# Altium schematic sheet Main.SchDoc
size A4
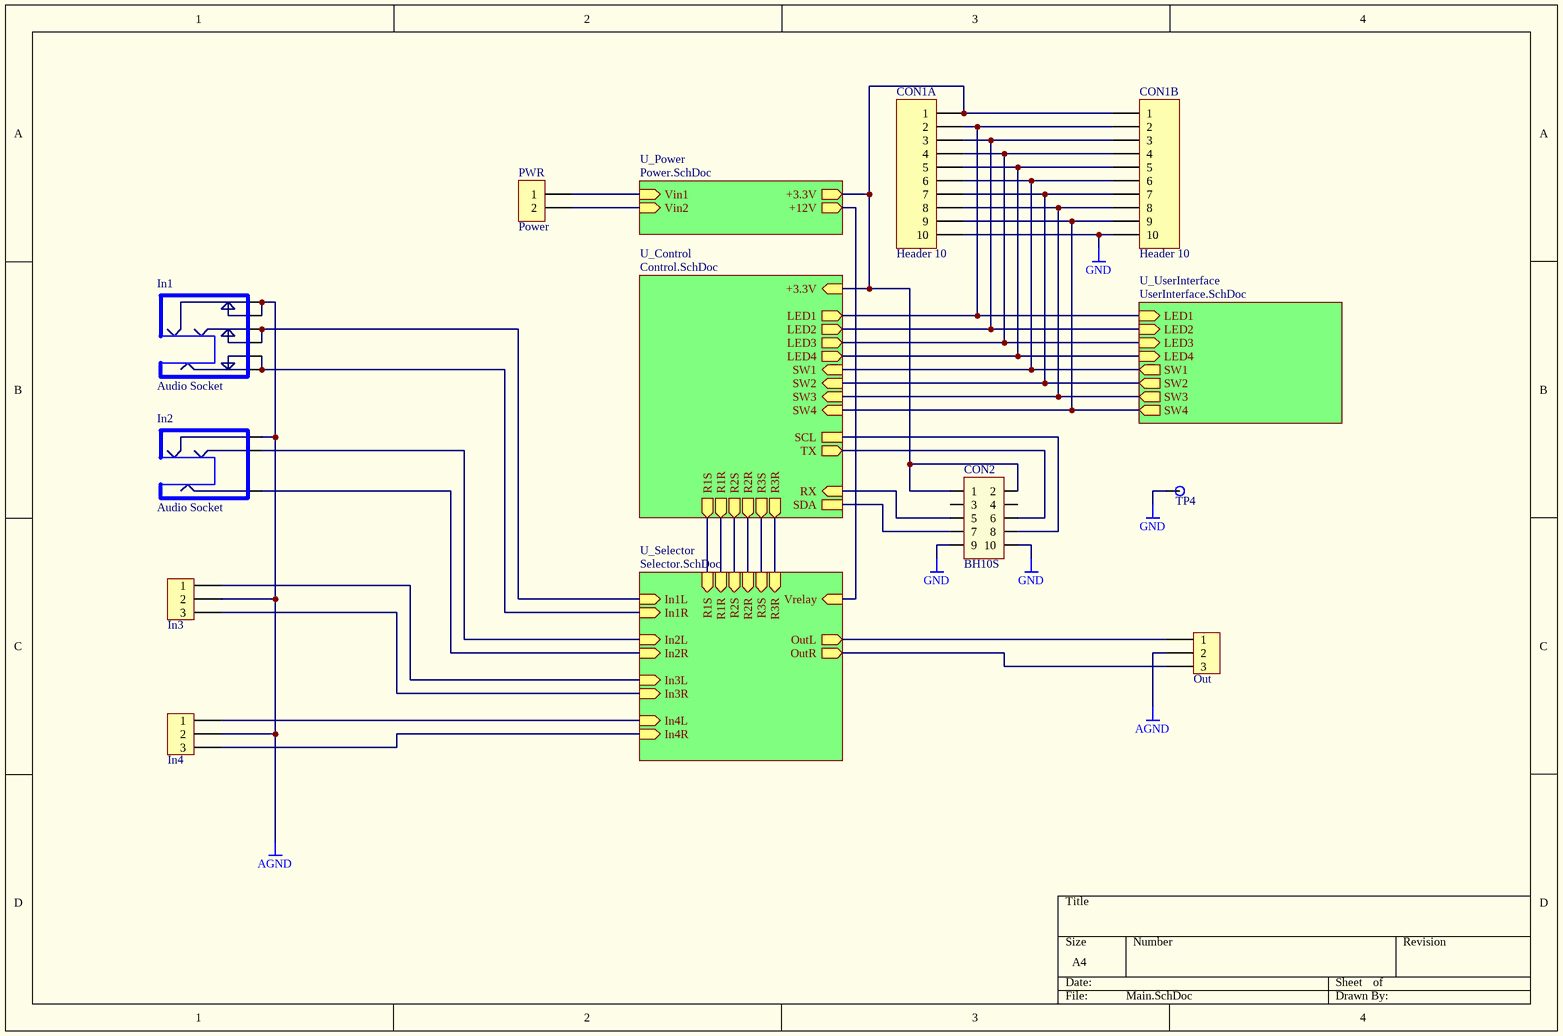
[diagram p0: Main.SchDoc]

## Parts
CON1A  Header 10  [JP10]
CON1B  Header 10  [JP10]
CON2  BH10S  [BH10S]
In1  Audio Socket  [Schurter4803.2330]
In2  Audio Socket  [MULTICOMP-MJ4435-R]
In3  CON3  [CON_WS03S]  (value not drawn)
In4  CON3  [CON_WS03S]  (value not drawn)
Out  CON3  [CON_WS03S]  (value not drawn)
PWR  Power  [CONN_TOP_2P]
TP4  TESTPAD  [MISC_PAD-36/65]  (value not drawn)

## Sub-sheets
U_Control = Control.SchDoc: SDA, SCL, TX (out), RX (in), +3.3V (in), R1S (out), R1R (out), R2S (out), R2R (out), R3S (out), R3R (out), LED1 (out), LED2 (out), LED3 (out), LED4 (out), SW1 (in), SW2 (in), SW3 (in), SW4 (in)
U_Power = Power.SchDoc: Vin1 (in), Vin2 (in), +12V (out), +3.3V (out)
U_Selector = Selector.SchDoc: In1L (in), In2L (in), In3L (in), In4L (in), In1R (in), In2R (in), In3R (in), In4R (in), OutL (out), OutR (out), Vrelay (in), R3R (in), R2S (in), R1R (in), R1S (in), R2R (in), R3S (in)
U_UserInterface = UserInterface.SchDoc: SW1 (out), SW2 (out), SW3 (out), SW4 (out), LED1 (in), LED2 (in), LED3 (in), LED4 (in)

## Nets
AGND: In1.3(GND) In1.4(GND) In2.1(GND) In3.2 In4.2 Out.2
GND: CON1A.10 CON1B.10 CON2.9 CON2.10 TP4.1
NetCON1A_1: CON1A.1 CON1B.1 CON2.1 CON2.2 ; sheet U_Control/+3.3V, sheet U_Power/+3.3V
NetCON1A_2: CON1A.2 CON1B.2 ; sheet U_Control/LED1, sheet U_UserInterface/LED1
NetCON1A_3: CON1A.3 CON1B.3 ; sheet U_Control/LED2, sheet U_UserInterface/LED2
NetCON1A_4: CON1A.4 CON1B.4 ; sheet U_Control/LED3, sheet U_UserInterface/LED3
NetCON1A_5: CON1A.5 CON1B.5 ; sheet U_Control/LED4, sheet U_UserInterface/LED4
NetCON1A_6: CON1A.6 CON1B.6 ; sheet U_Control/SW1, sheet U_UserInterface/SW1
NetCON1A_7: CON1A.7 CON1B.7 ; sheet U_Control/SW2, sheet U_UserInterface/SW2
NetCON1A_8: CON1A.8 CON1B.8 ; sheet U_Control/SW3, sheet U_UserInterface/SW3
NetCON1A_9: CON1A.9 CON1B.9 ; sheet U_Control/SW4, sheet U_UserInterface/SW4
NetCON2_5: CON2.5 ; sheet U_Control/RX
NetCON2_6: CON2.6 ; sheet U_Control/TX
NetCON2_7: CON2.7 ; sheet U_Control/SDA
NetCON2_8: CON2.8 ; sheet U_Control/SCL
NetIn1_1: In1.1(L) In1.6(L) ; sheet U_Selector/In1L
NetIn1_2: In1.2(R) In1.5(R) ; sheet U_Selector/In1R
NetIn2_2: In2.2(R) ; sheet U_Selector/In2R
NetIn2_3: In2.3(L) ; sheet U_Selector/In2L
NetIn3_1: In3.1 ; sheet U_Selector/In3L
NetIn3_3: In3.3 ; sheet U_Selector/In3R
NetIn4_1: In4.1 ; sheet U_Selector/In4L
NetIn4_3: In4.3 ; sheet U_Selector/In4R
NetOut_1: Out.1 ; sheet U_Selector/OutL
NetOut_3: Out.3 ; sheet U_Selector/OutR
NetPWR_1: PWR.1 ; sheet U_Power/Vin1
NetPWR_2: PWR.2 ; sheet U_Power/Vin2
(unnamed): sheet U_Control/R1S, sheet U_Selector/R1S
(unnamed): sheet U_Control/R1R, sheet U_Selector/R1R
(unnamed): sheet U_Control/R2S, sheet U_Selector/R2S
(unnamed): sheet U_Control/R2R, sheet U_Selector/R2R
(unnamed): sheet U_Control/R3S, sheet U_Selector/R3S
(unnamed): sheet U_Control/R3R, sheet U_Selector/R3R
(unnamed): sheet U_Power/+12V, sheet U_Selector/Vrelay

Not connected (* = marked no-connect by the designer): CON2 3 4

## Library data of the parts
CON1A CON1B = Header 10: Header, 10-Pin; Manufacturer: Generic Components; Class: Connector
CON2 = CON2x5: BH10S-side mounted
In1 = SOCKET_AUDIO_3WAY_SW
In2 = SOCKET_AUDIO_3WAY_NOSW
In3 In4 Out = CON3: Connector
PWR = CON2: Connector